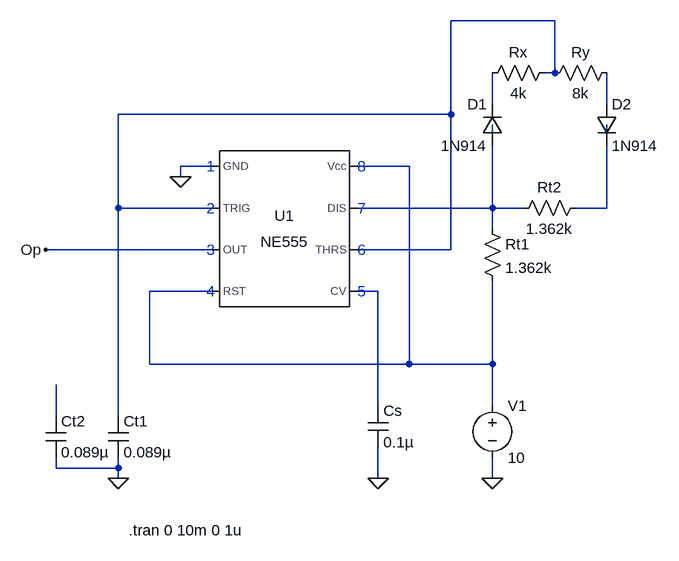
[diagram p0: schematic Task2_Final.asc]
Task2_Final.asc, the LTspice schematic file:
Version 4
SHEET 1 880 680
WIRE 608 -144 448 -144
WIRE 608 -64 608 -144
WIRE 608 -64 592 -64
WIRE 512 -16 512 -64
WIRE 688 -16 688 -64
WIRE 448 0 448 -144
WIRE 448 0 -64 0
WIRE 512 32 512 16
WIRE 688 32 688 16
WIRE 80 80 32 80
WIRE 384 80 304 80
WIRE 32 96 32 80
WIRE -64 144 -64 0
WIRE 80 144 -64 144
WIRE 512 144 512 48
WIRE 512 144 304 144
WIRE 560 144 512 144
WIRE 688 144 688 48
WIRE 688 144 640 144
WIRE 512 176 512 144
WIRE 80 208 -176 208
WIRE 448 208 448 0
WIRE 448 208 304 208
WIRE 80 272 -16 272
WIRE 336 272 304 272
WIRE -16 384 -16 272
WIRE 384 384 384 80
WIRE 384 384 -16 384
WIRE 512 384 512 256
WIRE 512 384 384 384
WIRE 336 448 336 272
WIRE 512 448 512 384
WIRE -160 464 -160 416
WIRE -64 464 -64 144
WIRE -160 544 -160 528
WIRE -64 544 -64 528
WIRE -64 544 -160 544
WIRE -64 560 -64 544
WIRE 336 560 336 512
WIRE 512 560 512 528
FLAG 512 560 0
FLAG 336 560 0
FLAG 32 96 0
FLAG -176 208 Op
FLAG -64 560 0
SYMBOL Misc\\NE555 192 176 R0
SYMATTR InstName U1
SYMBOL res 496 160 R0
SYMATTR InstName Rt1
SYMATTR Value 1.362k
SYMBOL cap 320 448 R0
SYMATTR InstName Cs
SYMATTR Value 0.1µ
SYMBOL voltage 512 432 R0
SYMATTR InstName V1
SYMATTR Value 10
SYMBOL cap -80 464 R0
SYMATTR InstName Ct1
SYMATTR Value 0.089µ
SYMBOL diode 528 48 R180
WINDOW 0 24 64 Left 2
WINDOW 3 24 0 Left 2
SYMATTR InstName D1
SYMATTR Value 1N914
SYMBOL res 656 128 R90
WINDOW 0 0 56 VBottom 2
WINDOW 3 32 56 VTop 2
SYMATTR InstName Rt2
SYMATTR Value 1.362k
SYMBOL diode 672 -16 R0
SYMATTR InstName D2
SYMATTR Value 1N914
SYMBOL res 608 -80 R90
WINDOW 0 0 56 VBottom 2
WINDOW 3 32 56 VTop 2
SYMATTR InstName Rx
SYMATTR Value 4k
SYMBOL res 704 -80 R90
WINDOW 0 0 56 VBottom 2
WINDOW 3 32 56 VTop 2
SYMATTR InstName Ry
SYMATTR Value 8k
SYMBOL cap -176 464 R0
SYMATTR InstName Ct2
SYMATTR Value 0.089µ
TEXT -48 640 Left 2 !.tran 0 10m 0 1u
TEXT 72 80 Left 2 ;1
TEXT 72 144 Left 2 ;2
TEXT 72 208 Left 2 ;3
TEXT 72 272 Left 2 ;4
TEXT 304 272 Left 2 ;5
TEXT 304 208 Left 2 ;6
TEXT 304 144 Left 2 ;7
TEXT 304 80 Left 2 ;8

The netlist it stands for:
* Task2_Final.asc
XU1 0 N001 Op N006 N009 N001 N007 N006 NE555  ; pins GND TRIG OUT RST CV THRS DIS Vcc
Rt1 N007 N006 1.362k
Cs N009 0 0.1µ
V1 N006 0 10
Ct1 N001 0 0.089µ
D1 N007 N002 1N914
Rt2 N008 N007 1.362k
D2 N003 N008 1N914
Rx N001 N002 4k
Ry N003 N001 8k
Ct2 N010 0 0.089µ
.model D D
.lib standard.dio
.tran 0 10m 0 1u
* 1
* 2
* 3
* 4
* 5
* 6
* 7
* 8
.lib NE555.sub
.backanno
.end